# Altium schematic sheet LED_16x_Schematic.SchDoc
size A4; DocumentNumber: 4; SheetNumber: 4; SheetTotal: 6
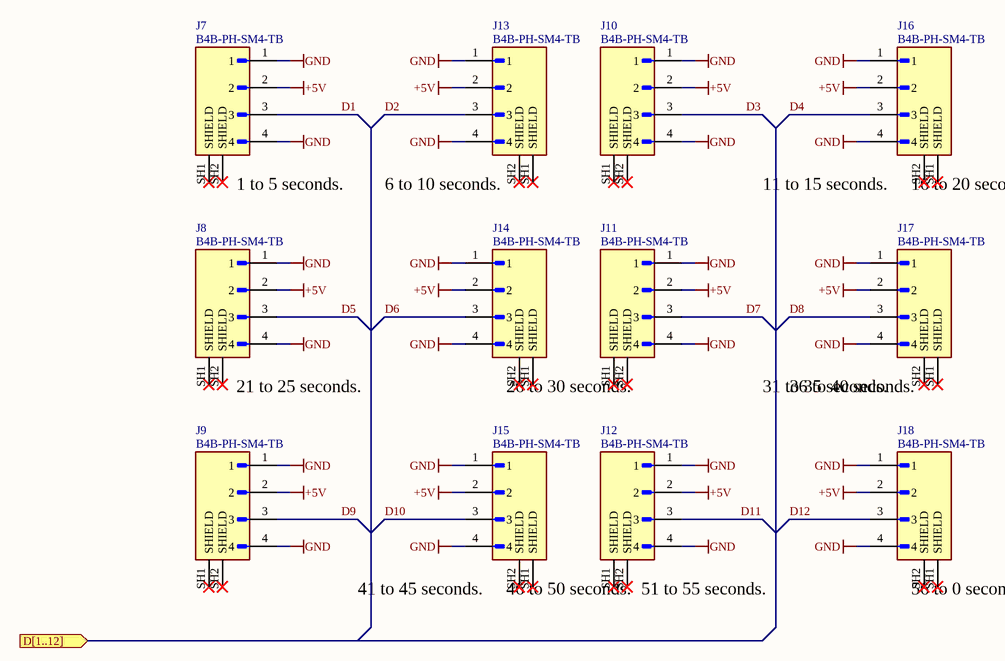
[diagram p0: LED_16x_Schematic.SchDoc]

## Parts
J7  B4B-PH-SM4-TB  [Connector_SMD]
J8  B4B-PH-SM4-TB  [Connector_SMD]
J9  B4B-PH-SM4-TB  [Connector_SMD]
J10  B4B-PH-SM4-TB  [Connector_SMD]
J11  B4B-PH-SM4-TB  [Connector_SMD]
J12  B4B-PH-SM4-TB  [Connector_SMD]
J13  B4B-PH-SM4-TB  [Connector_SMD]
J14  B4B-PH-SM4-TB  [Connector_SMD]
J15  B4B-PH-SM4-TB  [Connector_SMD]
J16  B4B-PH-SM4-TB  [Connector_SMD]
J17  B4B-PH-SM4-TB  [Connector_SMD]
J18  B4B-PH-SM4-TB  [Connector_SMD]

## Ports
D[1..12] (in)

## Nets
+5V: J7.2 J8.2 J9.2 J10.2 J11.2 J12.2 J13.2 J14.2 J15.2 J16.2 J17.2 J18.2
GND: J7.1 J7.4 J8.1 J8.4 J9.1 J9.4 J10.1 J10.4 J11.1 J11.4 J12.1 J12.4 J13.1 J13.4 J14.1 J14.4 J15.1 J15.4 J16.1 J16.4 J17.1 J17.4 J18.1 J18.4
D1: J7.3
D2: J13.3
D3: J10.3
D4: J16.3
D5: J8.3
D6: J14.3
D7: J11.3
D8: J17.3
D9: J9.3
D10: J15.3
D11: J12.3
D12: J18.3

Not connected (* = marked no-connect by the designer): J7 SH1(SHIELD)* SH2(SHIELD)*; J8 SH1(SHIELD)* SH2(SHIELD)*; J9 SH1(SHIELD)* SH2(SHIELD)*; J10 SH1(SHIELD)* SH2(SHIELD)*; J11 SH1(SHIELD)* SH2(SHIELD)*; J12 SH1(SHIELD)* SH2(SHIELD)*; J13 SH1(SHIELD)* SH2(SHIELD)*; J14 SH1(SHIELD)* SH2(SHIELD)*; J15 SH1(SHIELD)* SH2(SHIELD)*; J16 SH1(SHIELD)* SH2(SHIELD)*; J17 SH1(SHIELD)* SH2(SHIELD)*; J18 SH1(SHIELD)* SH2(SHIELD)*

## Notes on the sheet
- (near J7) 1 to 5 seconds.
- (near J13) 6 to 10 seconds.
- (near J10) 11 to 15 seconds.
- (near J16) 16 to 20 seconds.
- (near J8) 21 to 25 seconds.
- (near J14) 26 to 30 seconds.
- (near J11) 31 to 35 seconds.
- (near J17) 36 to 40 seconds.
- (near J9) 41 to 45 seconds.
- (near J15) 46 to 50 seconds.
- (near J12) 51 to 55 seconds.
- (near J18) 56 to 0 seconds.
- Date:
- Title of drawing:
- Time:
- Drawn by:
- Project:
- Revision:
- Institut:
- Departement:
- Page:
- from:
- File:

## Library data of the parts
J7-J18 = Connector_SMD: CONN HEADER SMD 4POS 2MM.; ComponentLink1Description: Supplier; ComponentLink1URL: https://www.digikey.ch/en/products/detail/jst-sales-america-inc/B4B-PH-SM4-TB/926643